# Altium schematic sheet ADC_Input.SchDoc: ADC Input
size Tabloid; Date: 06/01/2023; Engineer: Terry D. Schevker; Revision: 1.0; SheetNumber: 7; SheetTotal: 7
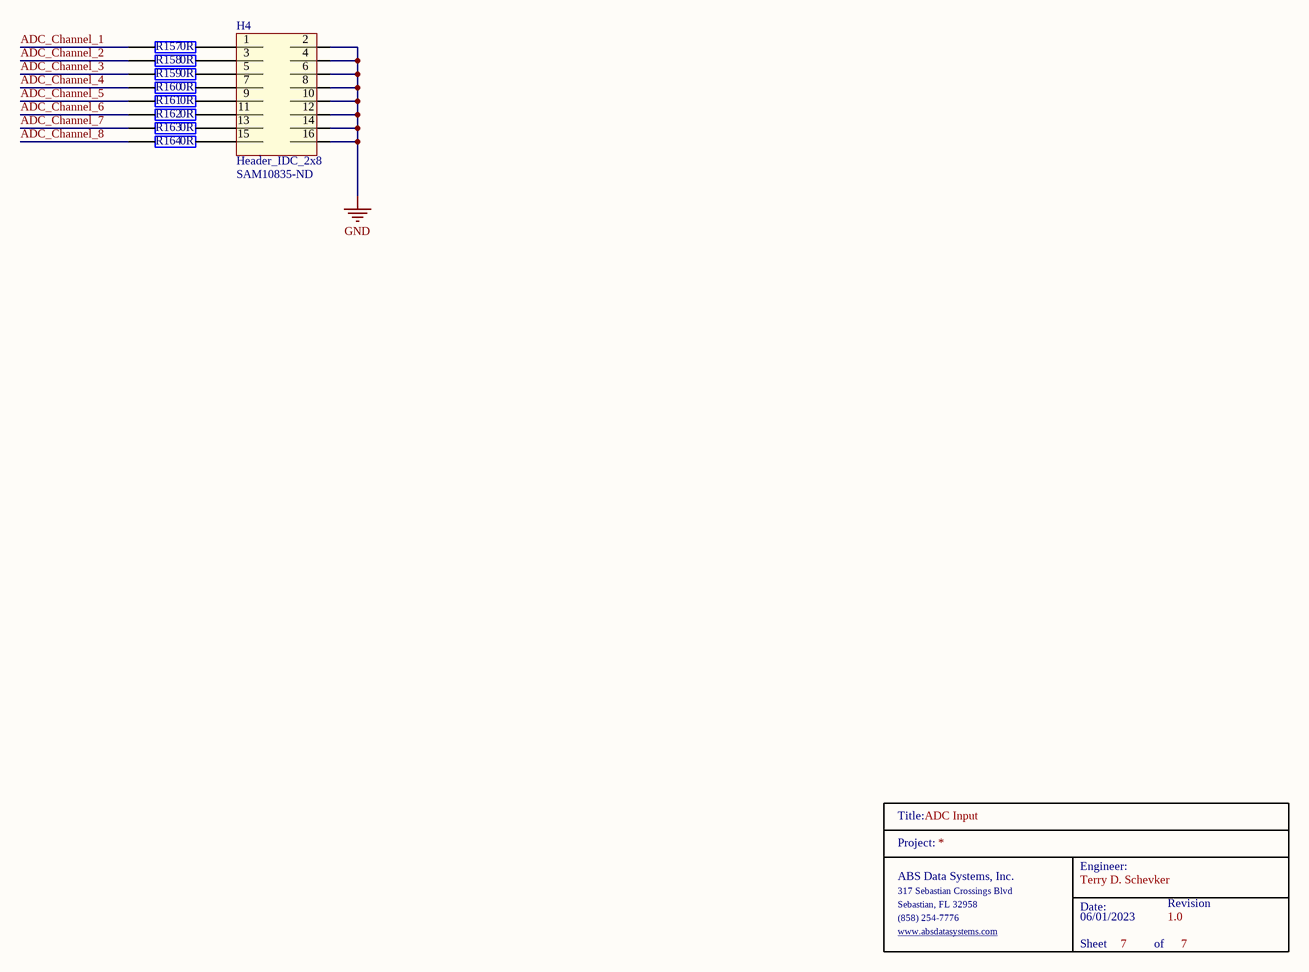
[diagram p0: ADC_Input.SchDoc]

## Parts
H4  Header_IDC_2x8  Supplier Part Number 1: SAM10835-ND  [HEADER16]
R157  0R  [0603]
R158  0R  [0603]
R159  0R  [0603]
R160  0R  [0603]
R161  0R  [0603]
R162  0R  [0603]
R163  0R  [0603]
R164  0R  [0603]
TitleBlock_7  TitleBlock  (value not drawn)  (graphical)

## Nets
GND: H4.2 H4.4 H4.6 H4.8 H4.10 H4.12 H4.14 H4.16
ADC_Channel_1: R157.1
ADC_Channel_2: R158.1
ADC_Channel_3: R159.1
ADC_Channel_4: R160.1
ADC_Channel_5: R161.1
ADC_Channel_6: R162.1
ADC_Channel_7: R163.1
ADC_Channel_8: R164.1
NetH4_1: H4.1 R157.2
NetH4_3: H4.3 R158.2
NetH4_5: H4.5 R159.2
NetH4_7: H4.7 R160.2
NetH4_9: H4.9 R161.2
NetH4_11: H4.11 R162.2
NetH4_13: H4.13 R163.2
NetH4_15: H4.15 R164.2

## Notes on the sheet
- (in symbol TitleBlock) Title:; Project:; Engineer:; ABS Data Systems, Inc.; 317 Sebastian Crossings Blvd; Sebastian, FL 32958; Date:; Revision; (858) 254-7776; www.absdatasystems.com; Sheet; of

## Library data of the parts
H4 = Header_IDC_2x8: 16 Pin 2x8 Through Hold IDC Connector; Manufacturer: Samtec; Manufacturer Part Number: TST-108-01-G-D; Number of Contacts: 16; Gender: Male; Connector Type: Male Pin; Pitch: 2.54mm; Row Spacing: 0.1inch; Supplier 1: Digi-Key; RoHS: Yes; Category: Headers and Wire Housings; Stock 1: 227; Pricing 1: 1=2.85000, 10=2.73600, 100=2.28000, 500=1.93800, 1000=1.65300, 5000=1.48200 (USD); Mount: Through Hole; Contact Plating: Gold; Contact Material: Bronze; Housing Material: Polyester; Housing Color: Black; Color: Black; Min Operating Temperature: -55°C; Max Operating Temperature: 125°C; Number of Rows: 2; Termination: Solder; Packaging: Rail/Tube; Orientation: Straight; Number of Positions: 16; Length: 27.94mm; Depth: 9.27mm; Contact Mating Length: 0.25inch; REACH SVHC: No SVHC; ComponentLink1URL: https://datasheet.ciiva.com/739/tst-mkt-739845.pdf?src-supplier=Digi-Key; ComponentLink1Description: https://datasheet.ciiva.com/739/tst-mkt-739845.pdf?src-supplier=Digi-Key; ComponentLink2URL: https://datasheet.ciiva.com/10018/htst-10018510.pdf?src-supplier=Avnet; ComponentLink2Description: https://datasheet.ciiva.com/10018/htst-10018510.pdf?src-supplier=Avnet
R157-R164 = RC0603JR-070RL: YAGEO 0603 0 ohm; Manufacturer_Name: KEMET; Geometry.Height: 0.55mm; Mouser Part Number: 603-RC0603JR-070RL; Mouser Price/Stock: https://www.mouser.co.uk/ProductDetail/YAGEO/RC0603JR-070RL?qs=2cAdsCoAWRGWyPcuXgGiXQ%3D%3D; Manufacturer_Part_Number: RC0603JR-070RL; Datasheet Link: https://datasheet.datasheetarchive.com/originals/distributors/Datasheets_SAMA/902f9e387b938f871d31120f5fc1d65e.pdf